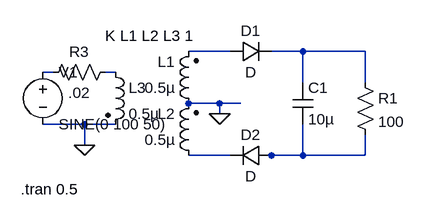
[diagram p0: schematic CentreTapTransformerPerfectModel.asc]
CentreTapTransformerPerfectModel.asc, the LTspice schematic file:
Version 4
SHEET 1 880 680
WIRE 224 48 160 48
WIRE 336 48 288 48
WIRE 432 48 336 48
WIRE -48 80 -64 80
WIRE 48 80 32 80
WIRE 336 96 336 48
WIRE 432 96 432 48
WIRE 208 128 160 128
WIRE 240 128 208 128
WIRE 208 144 208 128
WIRE 0 160 -64 160
WIRE 48 160 0 160
WIRE 0 192 0 160
WIRE 224 208 160 208
WIRE 288 208 272 208
WIRE 336 208 336 160
WIRE 336 208 288 208
WIRE 432 208 432 176
WIRE 432 208 336 208
FLAG 0 192 0
FLAG 208 144 0
SYMBOL ind2 176 144 R180
WINDOW 0 36 80 Left 2
WINDOW 3 36 40 Left 2
SYMATTR InstName L1
SYMATTR Value 0.5µ
SYMATTR Type ind
SYMBOL ind2 176 224 R180
WINDOW 0 36 80 Left 2
WINDOW 3 36 40 Left 2
SYMATTR InstName L2
SYMATTR Value 0.5µ
SYMATTR Type ind
SYMBOL ind2 32 64 R0
SYMATTR InstName L3
SYMATTR Value 0.5µ
SYMATTR Type ind
SYMBOL voltage -64 64 R0
WINDOW 123 0 0 Left 2
WINDOW 39 0 0 Left 2
SYMATTR InstName V1
SYMATTR Value SINE(0 100 50)
SYMBOL diode 224 64 R270
WINDOW 0 32 32 VTop 2
WINDOW 3 0 32 VBottom 2
SYMATTR InstName D1
SYMBOL res 48 64 R90
WINDOW 0 0 56 VBottom 2
WINDOW 3 32 56 VTop 2
SYMATTR InstName R3
SYMATTR Value .02
SYMBOL res 416 80 R0
SYMATTR InstName R1
SYMATTR Value 100
SYMBOL cap 320 96 R0
SYMATTR InstName C1
SYMATTR Value 10µ
SYMBOL diode 288 192 R90
WINDOW 0 0 32 VBottom 2
WINDOW 3 32 32 VTop 2
SYMATTR InstName D2
TEXT 32 24 Left 2 !K L1 L2 L3 1
TEXT -98 260 Left 2 !.tran 0.5

The netlist it stands for:
* CentreTapTransformerPerfectModel.asc
L1 0 N001 0.5µ
L2 N005 0 0.5µ
L3 N004 0 0.5µ
V1 N003 0 SINE(0 100 50)
D1 N001 N002 D
R3 N004 N003 .02
R1 N002 N006 100
C1 N002 N006 10µ
D2 N006 N005 D
.model D D
.lib standard.dio
K L1 L2 L3 1
.tran 0.5
.backanno
.end